# EAGLE design Nutriente_inferior (EAGLE 7.6.0)
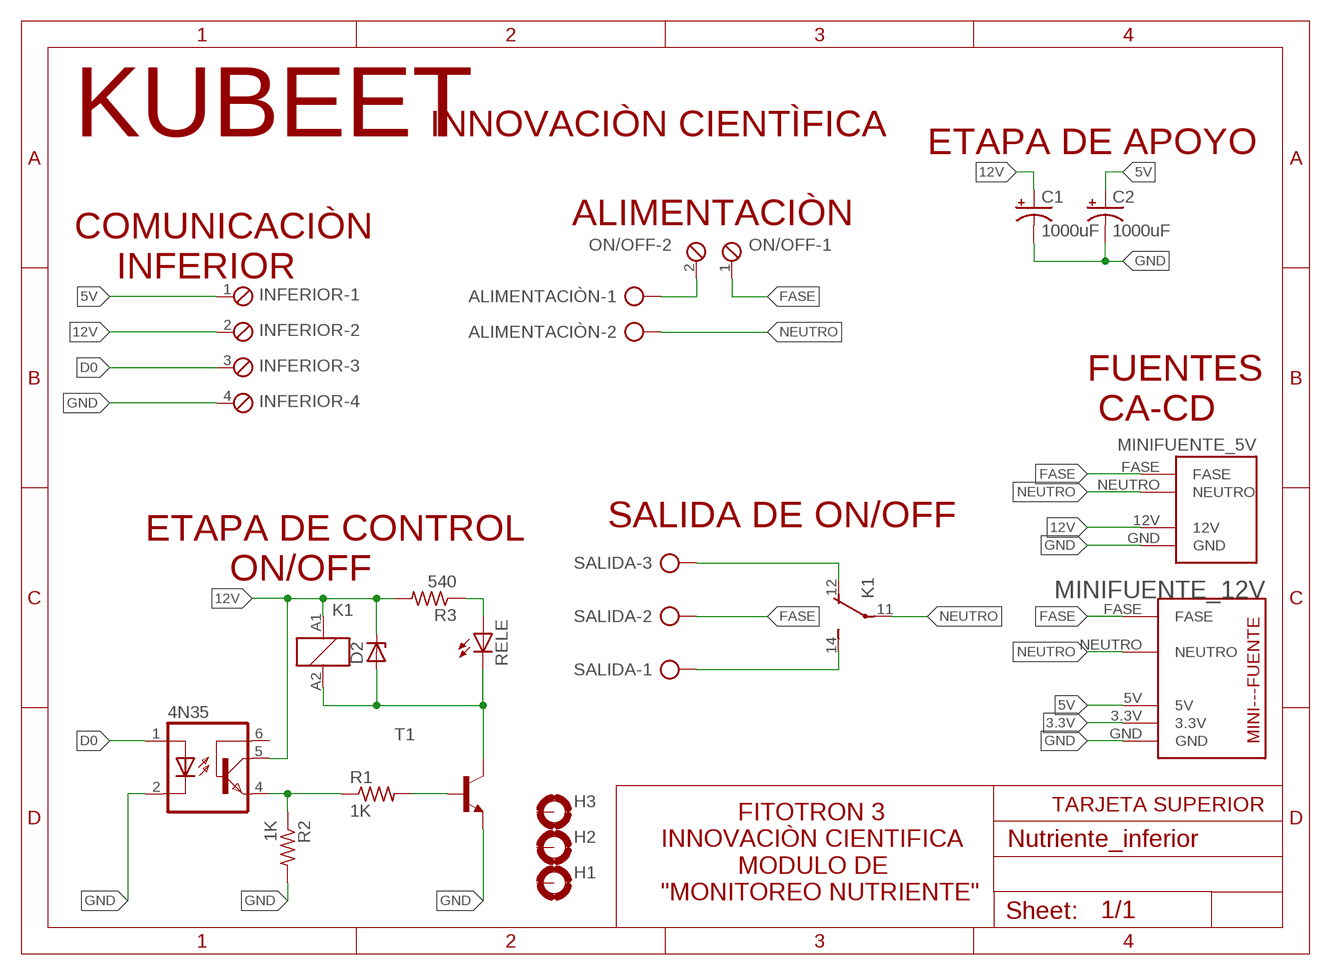
[diagram p0: schematic, sheet 1]

## Parts
4N35  4N35  [DIL06]
ALIMENTACIÒN  AK300/2  [AK300/2]
C1  1000uF  CPOL-USE3.5-10  [E3,5-10]
C2  1000uF  CPOL-USE3.5-10  [E3,5-10]
D2  1N821  [DO35Z10]
H1  MOUNT-PAD-ROUND3.0  [3,0-PAD]
H2  MOUNT-PAD-ROUND3.0  [3,0-PAD]
H3  MOUNT-PAD-ROUND3.0  [3,0-PAD]
INFERIOR  MPT4  [4POL254]
K1  ZNS5112  [ZN5]
MINIFUENTE_5V  MINIFUENTE4  [MINIFUENTE4]
MINIFUENTE_12V  MINIFUENTE3  [MINIFUENTE3]
ON/OFF  MPT2  [2POL254]
R1  1K  R-US_0207/7  [0207/7]
R2  1K  R-US_0207/7  [0207/7]
R3  540  R-US_0207/7  [0207/7]
RELE  LED5MM  [LED5MM]
SALIDA  AK300/3  [AK300/3]
T1  2N2222-NPN-TO92-EBC  [TO92-EBC]

## Nets
3.3V: MINIFUENTE_12V.3.3V
5V: C2.+ INFERIOR.1 MINIFUENTE_12V.5V
12V: 4N35.5(COL) C1.+ D2.C INFERIOR.2 K1.A1 MINIFUENTE_5V.12V R3.2
D0: 4N35.1(A) INFERIOR.3
FASE: MINIFUENTE_5V.FASE MINIFUENTE_12V.FASE ON/OFF.1 SALIDA.2
GND: 4N35.2(C) C1.- C2.- INFERIOR.4 MINIFUENTE_5V.GND MINIFUENTE_12V.GND R2.2 T1.E
N$1: ALIMENTACIÒN.1 ON/OFF.2
N$4: 4N35.4(EMI) R1.1 R2.1
N$6: R1.2 T1.B
N$8: R3.1 RELE.A
N$13: D2.A K1.A2 RELE.K(C) T1.C
N$14: K1.12(2:O) SALIDA.3
N$15: K1.14(2:S) SALIDA.1
NEUTRO: ALIMENTACIÒN.2 K1.11(2:P) MINIFUENTE_5V.NEUTRO MINIFUENTE_12V.NEUTRO
Unconnected: 4N35.6(BAS) H1.B3,0(MOUNT) H2.B3,0(MOUNT) H3.B3,0(MOUNT)

## Notes on the sheet
- KUBEET | INNOVACIÒN CIENTÌFICA
- ETAPA DE APOYO
- ALIMENTACIÒN
- COMUNICACIÒN 
      INFERIOR
- FUENTES 
   CA-CD
- SALIDA DE ON/OFF
- ETAPA DE CONTROL 
          ON/OFF
- TARJETA SUPERIOR
- FITOTRON 3
  INNOVACIÒN CIENTIFICA
             MODULO DE 
  "MONITOREO NUTRIENTE"

## Library data of the parts
4N35 = optocoupler:4N35: MOTOROLA OPTO COUPLER; MF: FAIRCHILD SEMICONDUCTOR; MPN: 4N35; OC_FARNELL: 1328375; OC_NEWARK: 72K9946
ALIMENTACIÒN = con-ptr500:AK300/2: CONNECTOR; OC_FARNELL: unknown; OC_NEWARK: unknown
C1 C2 = rcl:CPOL-US: POLARIZED CAPACITOR, American symbol
D2 = diode:1N821: Reference DIODE temperature compensated, 6,2 V
H1-H3 = holes:MOUNT-PAD-ROUND: MOUNTING PAD, round
INFERIOR = con-phoenix-254:MPT4: PHOENIX CONNECTOR; OC_FARNELL: unknown; OC_NEWARK: unknown
K1 = relay:ZNS5*: Miniature Power PCB Relay SCHRACK 1pole 10 A Source: http://www.schrack.com/.. 5847.pdf; OC_FARNELL: unknown; OC_NEWARK: unknown
MINIFUENTE_5V = CONECTORES RODAS:MINIFUENTE4
MINIFUENTE_12V = CONECTORES RODAS:MINIFUENTE3
ON/OFF = con-phoenix-254:MPT2: PHOENIX CONNECTOR; OC_FARNELL: unknown; OC_NEWARK: unknown
R1-R3 = rcl:R-US_: RESISTOR, American symbol
RELE = led:LED: LED OSRAM: - CHIPLED LG R971, LG N971, LY N971, LG Q971, LY Q971, LO R971, LY R971 LH N974, LH R974 LS Q976, LO Q976, LY Q976 LO Q996 - Hyper CHIPLED LW Q18S LB Q993, LB Q99A, LB R99A - SideLED LS A670, LO A670, LY A670, LG A670, LP A670 LB A673, LV A673, LT A673, LW A673 LH A674 LY A675 LS A676, LA A676, LO A676, LY A676, LW A676 LS A679, LY A679, LG A679 - Hyper Micro SIDELED® LS Y876, LA Y876, LO Y876, LY Y876 LT Y87S - SmartLED LW L88C, LW L88S LB L89C, LB L89S, LG L890 LS L89K, LO L89K, LY L89K LS L896, LA L896, LO L896, LY L896 - TOPLED LS T670, LO T670, LY T670, LG T670, LP T670 LSG T670, LSP T670, LSY T670, LOP T670, LYG T670 LG T671, LOG T671, LSG T671 LB T673, LV T673, LT T673, LW T673 LH T674 LS T676, LA T676, LO T676, LY T676, LB T676, LH T676, LSB T676, LW T676 LB T67C, LV T67C, LT T67C, LS T67K, LO T67K, LY T67K, LW E67C LS E67B, LA E67B, LO E67B, LY E67B, LB E67C, LV E67C, LT E67C LW T67C LS T679, LY T679, LG T679 LS T770, LO T770, LY T770, LG T770, LP T770 LB T773, LV T773, LT T773, LW T773 LH T774 LS E675, LA E675, LY E675, LS T675 LS T776, LA T776, LO T776, LY T776, LB T776 LHGB T686 LT T68C, LB T68C - Hyper Mini TOPLED® LB M676 - Mini TOPLED Santana® LG M470 LS M47K, LO M47K, LY M47K Source: http://www.osram.convergy.de LUXEON: - LUMILED® LXK2-PW12-R00, LXK2-PW12-S00, LXK2-PW14-U00, LXK2-PW14-V00 LXK2-PM12-R00, LXK2-PM12-S00, LXK2-PM14-U00 LXK2-PE12-Q00, LXK2-PE12-R00, LXK2-PE12-S00, LXK2-PE14-T00, LXK2-PE14-U00 LXK2-PB12-K00, LXK2-PB12-L00, LXK2-PB12-M00, LXK2-PB14-N00, LXK2-PB14-P00, LXK2-PB14-Q00 LXK2-PR12-L00, LXK2-PR12-M00, LXK2-PR14-Q00, LXK2-PR14-R00 LXK2-PD12-Q00, LXK2-PD12-R00, LXK2-PD12-S00 LXK2-PH12-R00, LXK2-PH12-S00 LXK2-PL12-P00, LXK2-PL12-Q00, LXK2-PL12-R00 Source: www.luxeon.com KINGBRIGHT: KA-3528ASYC Source: www.kingbright.com
SALIDA = con-ptr500:AK300/3: CONNECTOR; OC_FARNELL: unknown; OC_NEWARK: unknown
T1 = transistor-neu-to92:*-NPN-: NPN Transistror

## Board
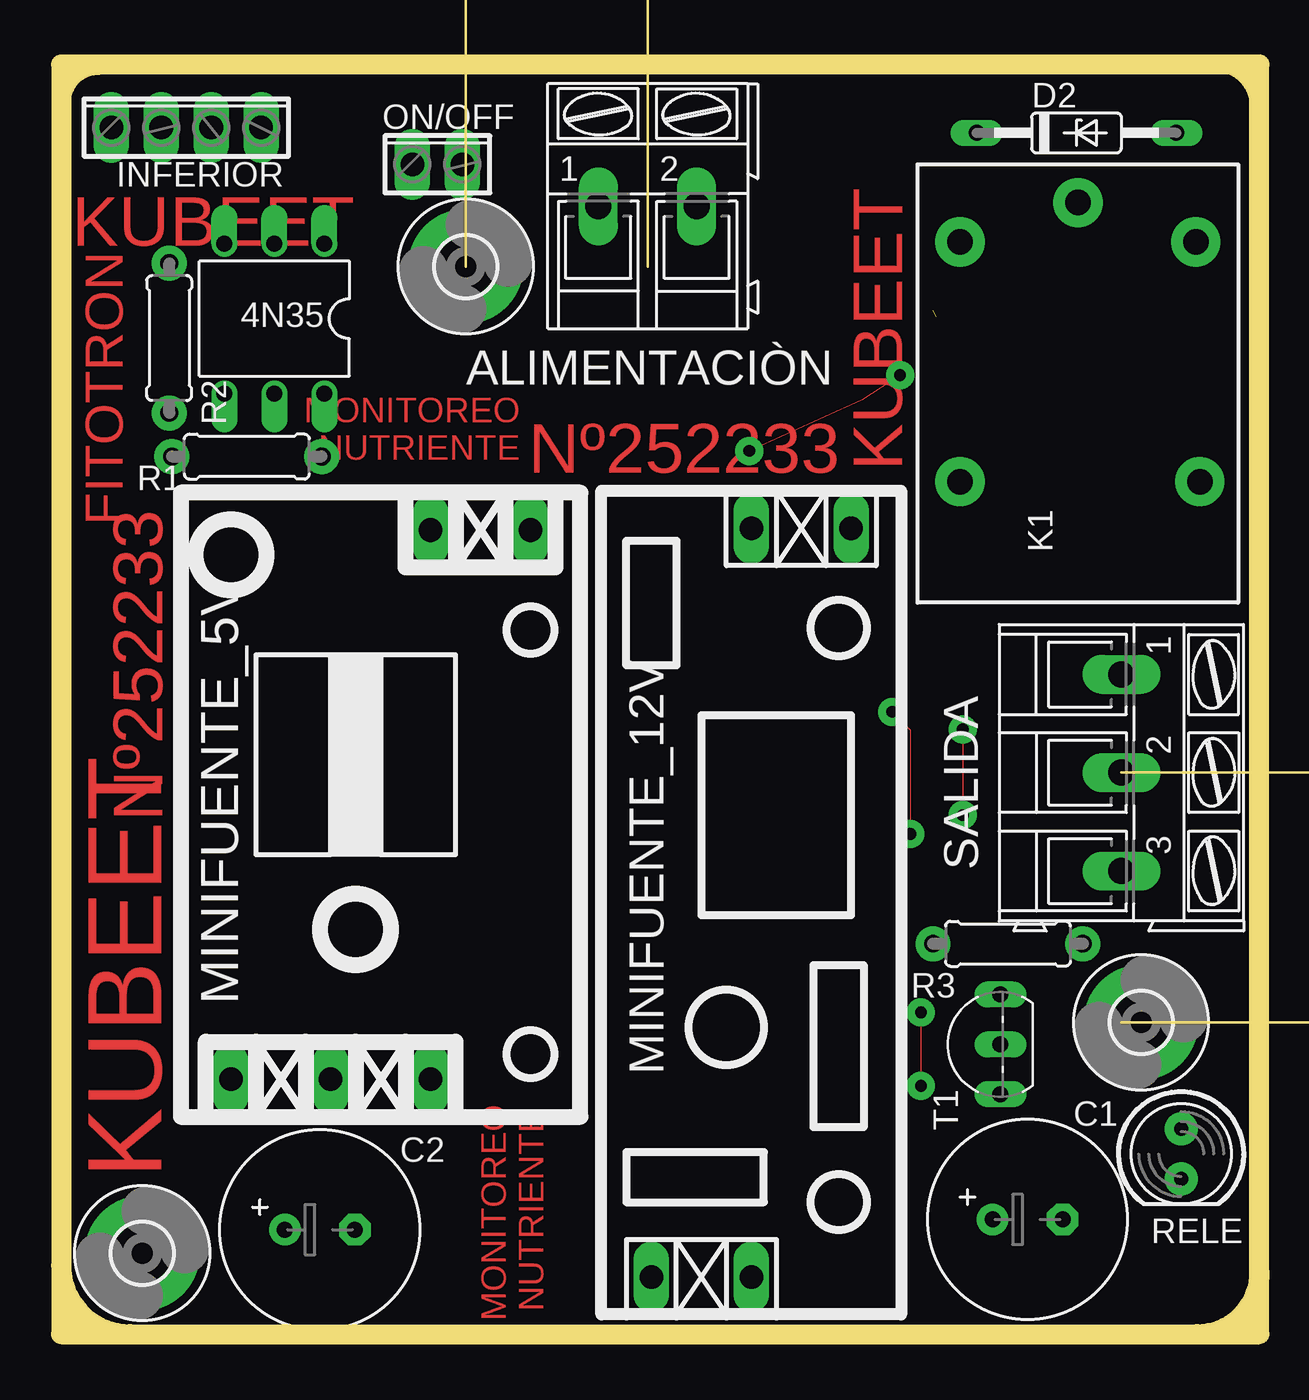
[diagram p1: board, top side]
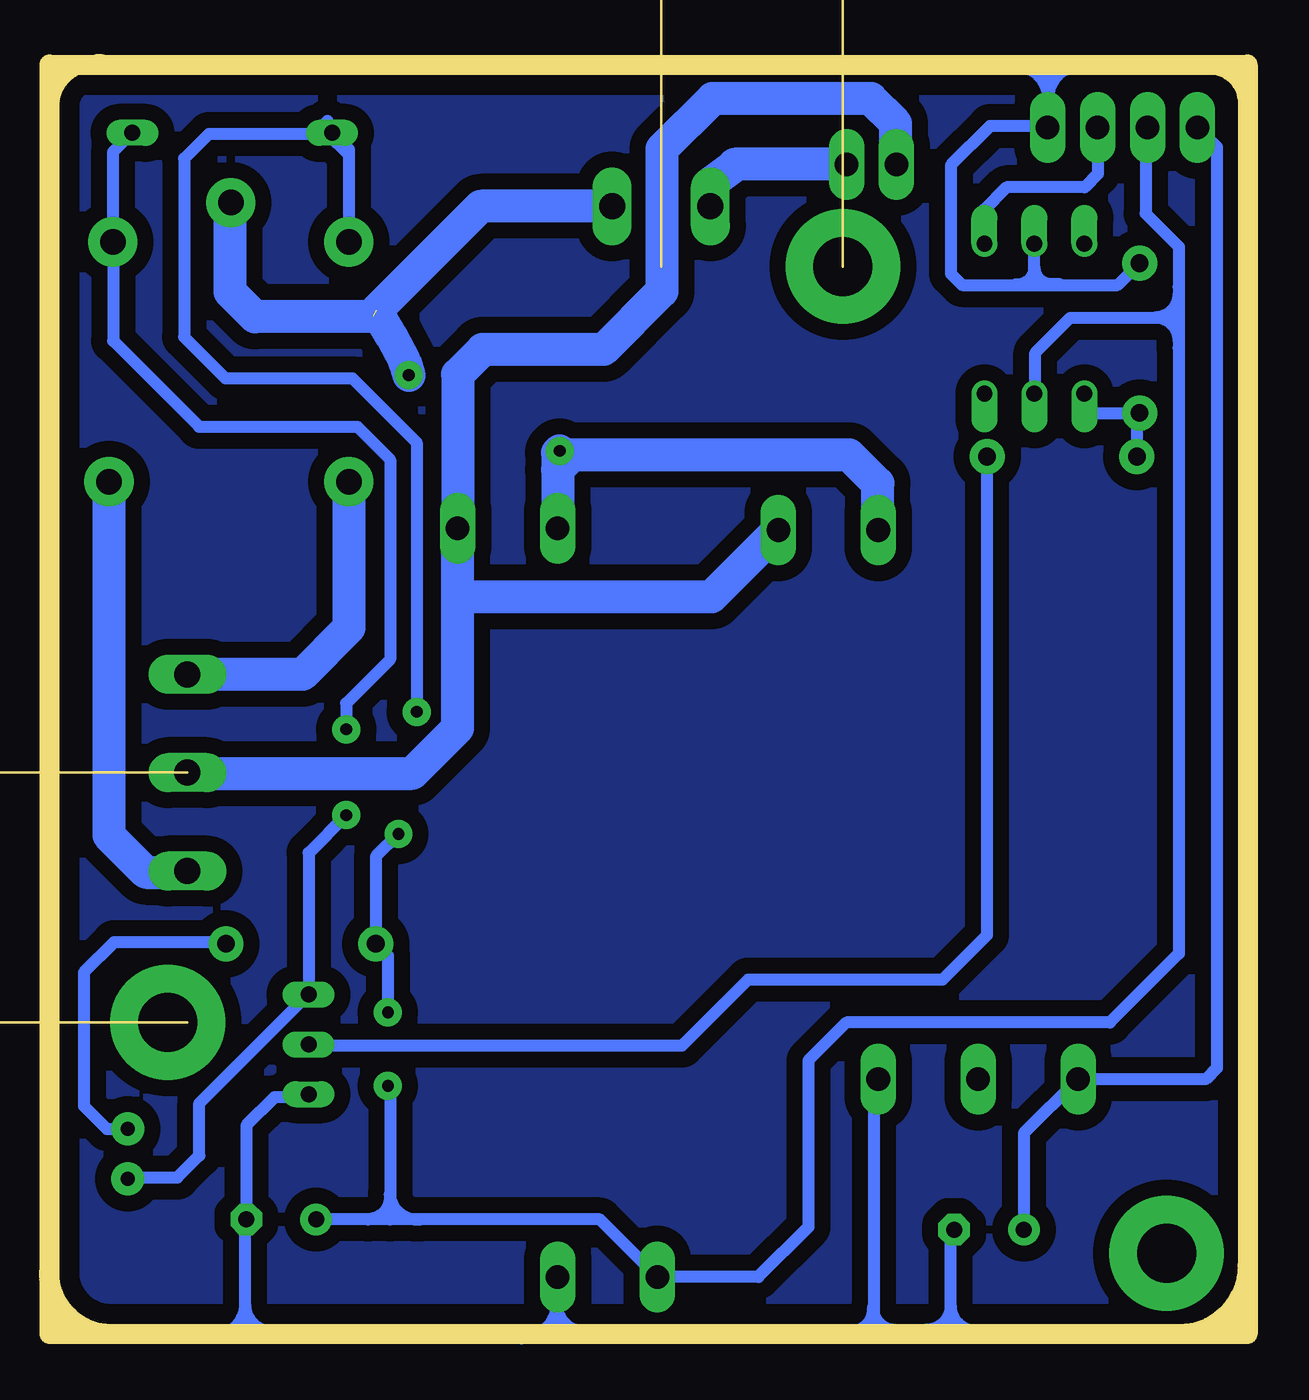
[diagram p2: board, bottom side, seen from below]

Size 60.96 x 64.62 mm. Coordinates in mm from the lower left corner, seen from the top.
Outline: 0.64,0 0,0 0,3.49
Outline: 0.64,0 3.49,0
Outline: 3.49,0 57.78,0
Outline: 57.78,0 60.94,0 60.94,64.61 0,64.61 0,3.49
Outline: 0,3.49 arc90 3.49,0
Outline: 0.64,0.64 0.64,0
Outline: 57.78,0 arc90 60.96,3.17
Outline: 60.64,0.32 arc90 60.33,0.64
Outline: 58.25,64.62 58.56,64.62
Outline: 0.18,62.14 0.18,62.62 arc-90 1.95,64.4
Outline: 58.49,64.58 58.63,64.58 arc-90 60.77,62.43
Copper layers (1*16): Top 0.035mm / dielectric 1.5mm / Bottom 0.035mm
Design rules "default": minimum track width 10mil, minimum drill 24mil, track to track 8mil, track to pad 8mil, pad to pad 8mil, via to via 8mil, smd to smd 8mil, copper to edge 40mil, drill to drill 8mil, minimum pad ring 10mil, minimum via ring 8mil, stop-mask expansion 4mil, vias tented up to drill 0mil, thermal gap 10mil
Milling: area 66.2,27.1 to 66.8,28.6; area 66.2,15.9 to 66.8,17.4; area 66.9,19.5 to 68.7,25; area 20.6,74.6 to 22.1,75.2; area 28.3,74.6 to 29.8,75.2; area 22.4,75.3 to 28,77.1; 6 lines

### Footprints (pad centres in the part's own frame; a part is rotated, then mirrored left to right if it is on the bottom)
DIL06 = drill 0.813 offset: 1 -2.54,-3.81; 2 0,-3.81; 3 2.54,-3.81; 4 2.54,3.81; 5 0,3.81; 6 -2.54,3.81
AK300/2 = drill 1.321 long: 1 -2.515,0; 2 2.489,0
E3,5-10 = drill 0.813 pad 1.6: + -1.778,0 | drill 0.813 pad 1.6 octagon: - 1.778,0
DO35Z10 = drill 0.813 long: A 5.08,0; C -5.08,0
3,0-PAD = drill 3 pad 5.842: B3,0 0,0
4POL254 = drill 1.2 long: 1 -3.81,0; 2 -1.27,0; 3 1.27,0; 4 3.81,0
ZN5 = drill 1.3 pad 2.5: 11 8.89,0; 12 -5.31,-6.2; 14 -5.31,6; A1 6.89,6; A2 6.89,-6
MINIFUENTE4 = drill 1.2 pad 1.676 long: 12V 40.005,2.54; FASE 1.905,12.7; GND 40.005,7.62; NEUTRO 1.905,7.62
MINIFUENTE3 = drill 1.2 pad 1.676 long: 3.3V 29.21,7.62; 5V 29.21,2.54; FASE 1.27,17.78; GND 29.21,12.7; NEUTRO 1.27,12.7
2POL254 = drill 1.2 long: 1 -1.27,0; 2 1.27,0
0207/7 = drill 0.9 pad 1.778: 1 -3.81,0; 2 3.81,0
LED5MM = drill 0.7 pad 1.676: A -1.27,0; K 1.27,0
AK300/3 = drill 1.321 long: 1 -5.004,0; 2 0,0; 3 5.004,0
TO92-EBC = drill 0.813 long: B 0,-1.27; C 2.54,-1.27; E -2.54,-1.27

### Placement (x,y rotation side)
4N35  10.85,51.67 180 top
ALIMENTACIÒN  29.84,57.39 0 top
C1  49.16,5.84 0 top
C2  13.16,5.32 0 top
D2  51.64,61.13 0 top
H1  20.59,54.33 0 top
H2  54.93,15.88 0 top
H3  4.13,4.13 0 top
INFERIOR  6.36,61.4 0 top
K1  51.72,48.69 90 top
MINIFUENTE_5V  27.48,42.92 270 top
MINIFUENTE_12V  6.09,42.19 270 top
ON/OFF  19.14,59.52 0 top
R1  9.44,44.66 0 top
R2  5.5,50.69 90 top
R3  48.16,19.87 180 top
RELE  56.97,9.18 270 top
SALIDA  53.93,28.57 270 top
T1  46.5,14.75 90 top

### Tracks (layer width: path | path; a pad name or v marks a point on that pad's centre or on a via)
5V
  Bottom 0.61: C2.+ 11.38,10.23 MINIFUENTE_12V.5V 2.14,12.98 1.57,13.55 1.57,60.41 INFERIOR.1
12V  (via drill 0.6 pad 1.42)
  Top 0: v43.73,16.37 v43.73,12.64 | v42.27,31.67 43.19,30.75 v43.19,25.45
  Bottom 0.61: 43.61,5.84 32.95,5.84 MINIFUENTE_5V.12V 24.89,2.91 22.35,5.45 22.35,13.93 20.42,15.86 7.01,15.86 3.5,19.37 3.5,51.72 | 43.61,5.84 C1.+ | D2.C 45.72,60.28 K1.A1 45.71,55.59 45.71,59.98 46.8,61.07 46.8,61.74 47.47,61.07 52.84,61.07 54.09,59.81 54.09,50.74 51.99,48.64 45.54,48.64 42.27,45.37 v42.27,31.67 | INFERIOR.2 5.2,61.3 5.2,57.02 3.5,55.33 3.5,51.72 | 4N35.5 10.79,47.91 10.79,49.94 9.01,51.72 3.5,51.72 | v43.73,16.37 43.73,19.25 R3.2 44.35,24.3 v43.19,25.45 | v43.73,12.64 43.61,12.53 43.61,5.84
D0
  Bottom 0.61: INFERIOR.3 7.62,61.38 7.62,59.04 8.3,58.36 12.27,58.36 13.43,57.2 4N35.1
FASE
  Bottom 1.676: ON/OFF.1 17.9,59.97 17.9,61.61 19.17,62.87 27.22,62.87 29.79,60.3 29.79,53.07 32.75,50.1 38.91,50.1 40.18,48.84 MINIFUENTE_5V.FASE 40.18,37.52 | SALIDA.2 53.89,28.54 42.48,28.54 40.18,30.84 40.18,37.52 | MINIFUENTE_12V.FASE 27.27,37.52 40.18,37.52
GND
  Bottom 0.61: MINIFUENTE_5V.GND 35.13,2.88 35.13,-0.08 | 35.13,-0.08 34.84,0.21 19.01,0.21 | 19.01,0.21 15.13,0.21 | 15.13,0.21 0.28,0.21 0,0.49 0,64.71 0.07,64.78 10.27,64.78 10.17,64.68 INFERIOR.4 10.24,61.47 13.1,61.47 15.09,59.48 15.09,53.95 14.52,53.38 10.85,53.38 | C2.- 15.13,5.12 15.13,0.21 | MINIFUENTE_12V.GND 19.01,12.76 19.01,0.21 | 35.13,-0.08 51.01,-0.08 51.02,-0.07 51.02,5.76 C1.- 50.93,10.62 49.49,12.06 47.77,12.06 T1.E | R2.2 6.62,53.38 10.85,53.38 | 10.85,53.38 4N35.2
N$1
  Bottom 1.676: ON/OFF.2 26.11,59.52 25.98,59.52 27.32,58.55 ALIMENTACIÒN.1
N$4
  Bottom 0.61: R1.1 5.63,46.74 R2.1 8.23,46.88 8.37,46.74 8.37,47.8 4N35.4
N$6
  Bottom 0.61: T1.B 47.71,14.69 28.77,14.69 25.41,18.05 15.52,18.05 13.26,20.31 R1.2
N$8
  Bottom 0.61: R3.1 52.03,19.94 57.65,19.94 59.19,18.4 59.19,11.61 58.02,10.45 RELE.A
N$10
  pour Bottom (isolate 0.813): 0.24,0.24 61.07,0.24 61.07,64.61 0.12,64.61 0.12,2.27
N$12
  Bottom 0.61: 13.24,0.16 13.8,0.16 arc90 15.11,1.47 15.11,1.45 arc90 16.32,0.23
N$13  (via drill 0.6 pad 1.42)
  Top 0: v45.85,30.78 v45.85,26.41
  Bottom 0.61: D2.A 57.72,60.13 K1.A2 57.7,55.56 57.7,50.55 53.34,46.18 45.29,46.18 43.61,44.5 43.61,34.34 45.85,32.1 v45.85,30.78 | RELE.K 56.9,7.97 54.44,7.97 53.32,9.09 53.32,11.75 47.78,17.29 T1.C 47.77,24.5 v45.85,26.41
N$14
  Bottom 1.676: K1.12 57.92,25.38 56.04,23.5 53.99,23.5 SALIDA.3
N$15
  Bottom 1.676: K1.14 45.72,35.94 48.07,33.58 54.43,33.58 54.57,33.44 54.06,33.44 SALIDA.1
N$16
  Bottom 0.61: 17.52,0.21 17.91,0.21 arc90 19.06,1.36 19.06,1.31 arc90 20.3,0.07 | 20.3,0.07 | 20.3,0.07 arc90 20.27,0.09 20.53,0.09 arc-90 20.67,-0.05
N$17
  Bottom 0.61: 32.69,0.07 33.6,0.07 arc90 35.15,1.61 35.15,1.59 arc90 36.95,-0.21
N$18
  Bottom 0.61: 48.25,0.1 49.53,0.1 arc90 50.99,1.56 arc90 52.63,-0.08 52.83,-0.08
N$19
  Bottom 0.61: 3.52,53.28 3.52,52.91 arc90 4.7,51.74 arc90 3.52,50.56 3.52,50.18
N$20
  Bottom 0.61: 9.54,53.42 9.97,53.42 arc90 10.84,54.29 arc90 11.74,53.4 11.87,53.4
N$21
  Bottom 0.61: 42.09,5.83 42.26,5.83 arc90 43.62,7.19 43.62,6.97 arc90 44.75,5.84
N$22
  Bottom 0.61: 8.28,64.56 8.46,64.56 arc-90 10.15,62.86 arc-90 11.83,64.54 12,64.54
N$23
  pour Bottom (isolate 0.813): 1.04,0.35 60.53,0.35 60.53,64.1 0.52,64.1 0.52,2.09
NEUTRO  (via drill 0.6 pad 1.42)  (1 unrouted)
  Top 0: v42.67,48.8 40.73,47.53 v35,44.95
  Bottom 1.676: 44.49,51.77 50.49,51.77 51.76,53.03 51.76,57.54 K1.11 | MINIFUENTE_12V.NEUTRO 18.81,40.94 18.81,43.28 20.27,44.74 32.38,44.74 | 32.38,44.74 | 32.38,44.74 34.35,44.74 35.1,43.99 | 35.1,43.99 MINIFUENTE_5V.NEUTRO | v42.67,48.8 42.88,49.48 43.55,50.78 44.32,52.08 39.01,57.39 ALIMENTACIÒN.2 | v35,44.95 35.1,44.84 35.1,43.99

### Text on the board
Top: KUBEET | FITOTRON | MONITOREO / NUTRIENTE | Nº252233 | KUBEET | Nº252233 | KUBEET | MONITOREO / NUTRIENTE